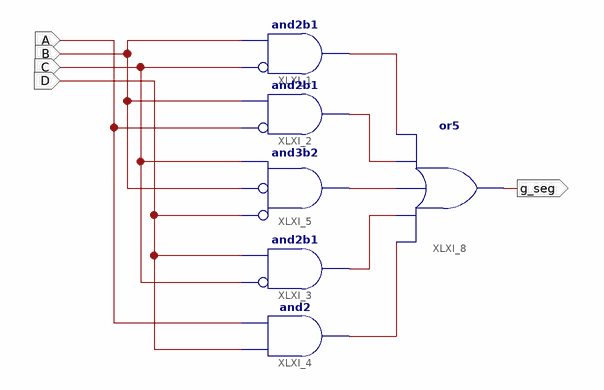
[diagram p0: schematic sheet 1]
// Xilinx ISE schematic bcd4to7g.sch (spartan6) as structural Verilog: 6 symbols, 5 ports
module bcd4to7g (
  input  A,
  input  B,
  input  C,
  input  D,
  output g_seg
);

  wire XLXN_1, XLXN_2, XLXN_3, XLXN_4, XLXN_5;

  and XLXI_1 (XLXN_1, ~C, B);  // and2b1
  and XLXI_2 (XLXN_2, ~A, B);  // and2b1
  and XLXI_5 (XLXN_3, ~D, ~B, C);  // and3b2
  and XLXI_3 (XLXN_4, ~C, D);  // and2b1
  and XLXI_4 (XLXN_5, D, A);
  or XLXI_8 (g_seg, XLXN_5, XLXN_4, XLXN_3, XLXN_2, XLXN_1);
endmodule
